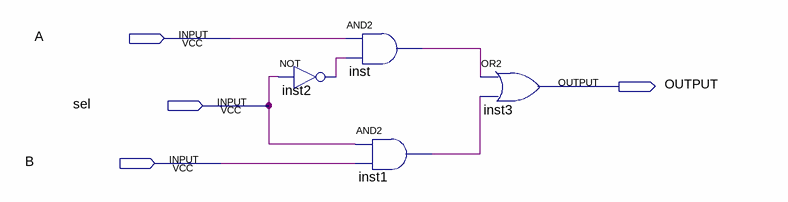
[diagram p0: schematic sheet]
// Quartus schematic mux2x1.bdf as structural Verilog: 4 symbols, 4 pins
module mux2x1 (
  input  A,
  input  sel,
  input  B,
  output OUTPUT
);

  wire inst1_out, inst2_out, inst_out;

  not inst2 (inst2_out, sel);
  and inst (inst_out, A, inst2_out);
  and inst1 (inst1_out, sel, B);
  or inst3 (OUTPUT, inst_out, inst1_out);
endmodule
